# Altium schematic sheet HeartBeat.SchDoc
size A4; SheetNumber: 1; SheetTotal: 1
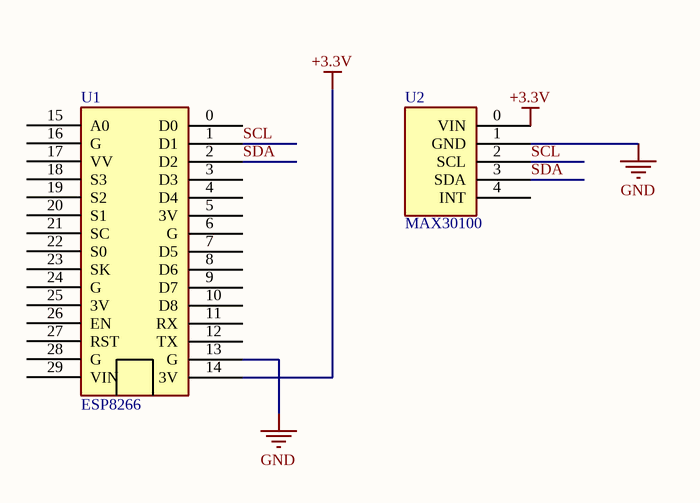
[diagram p0: HeartBeat.SchDoc]

## Parts
U1  ESP8266  [ESP8266]
U2  MAX30100  [MAX30100]

## Nets
+3.3V: U1.14(3V) U2.0(VIN)
GND: U1.13(G) U2.1(GND)
SCL: U1.1(D1) U2.2(SCL)
SDA: U1.2(D2) U2.3(SDA)

Not connected (* = marked no-connect by the designer): U1 0(D0) 3(D3) 4(D4) 5(3V) 6(G) 7(D5) 8(D6) 9(D7) 10(D8) 11(RX) 12(TX) 15(A0) 16(G) 17(VV) 18(S3) 19(S2) 20(S1) 21(SC) 22(S0) 23(SK) 24(G) 25(3V) 26(EN) 27(RST) 28(G) 29(VIN); U2 4(INT)

## Library data of the parts
U1 = ESP8266: ESP8266-12E
U2 = MAX30100: MAX30100-GY